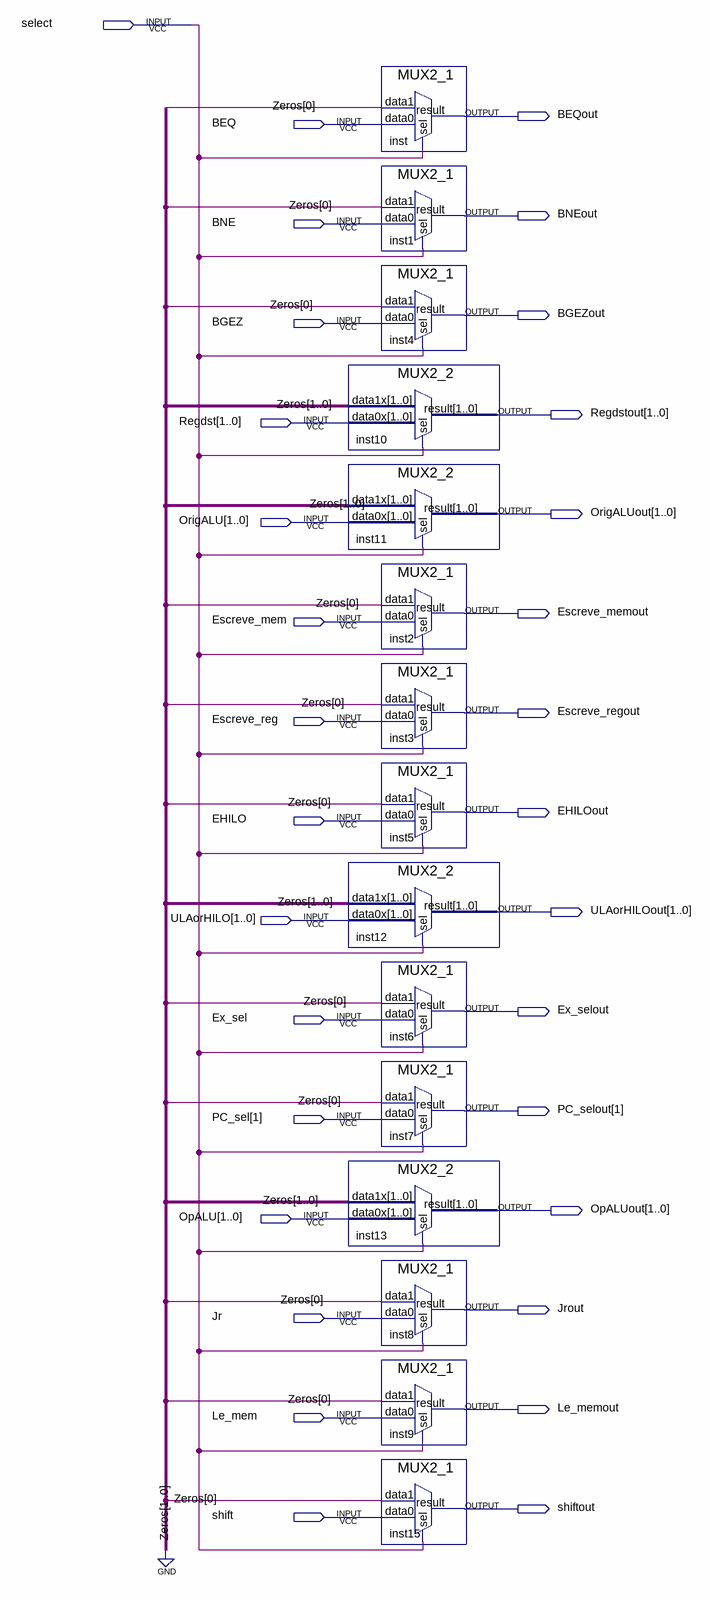
[diagram p0: schematic sheet]
// Quartus schematic MUXcontrole.bdf as structural Verilog: 15 symbols, 31 pins
module MUXcontrole (
  input  select,
  input  BEQ,
  input  BNE,
  input  BGEZ,
  input  [1:0] Regdst,
  input  [1:0] OrigALU,
  input  Escreve_mem,
  input  Escreve_reg,
  input  EHILO,
  input  [1:0] ULAorHILO,
  input  Ex_sel,
  input  [1:1] PC_sel,
  input  [1:0] OpALU,
  input  Jr,
  input  Le_mem,
  input  shift,
  output BEQout,
  output BNEout,
  output BGEZout,
  output [1:0] Regdstout,
  output [1:0] OrigALUout,
  output Escreve_memout,
  output Escreve_regout,
  output EHILOout,
  output [1:0] ULAorHILOout,
  output Ex_selout,
  output [1:1] PC_selout,
  output [1:0] OpALUout,
  output Jrout,
  output Le_memout,
  output shiftout
);

  MUX2_1 inst (.data1(1'b0), .data0(BEQ), .sel(select), .result(BEQout));
  MUX2_1 inst1 (.data1(1'b0), .data0(BNE), .sel(select), .result(BNEout));
  MUX2_1 inst4 (.data1(1'b0), .data0(BGEZ), .sel(select), .result(BGEZout));
  MUX2_2 inst10 (.data1x(2'b00), .data0x(Regdst), .sel(select), .result(Regdstout));
  MUX2_2 inst11 (.data1x(2'b00), .data0x(OrigALU), .sel(select), .result(OrigALUout));
  MUX2_1 inst2 (.data1(1'b0), .data0(Escreve_mem), .sel(select), .result(Escreve_memout));
  MUX2_1 inst3 (.data1(1'b0), .data0(Escreve_reg), .sel(select), .result(Escreve_regout));
  MUX2_1 inst5 (.data1(1'b0), .data0(EHILO), .sel(select), .result(EHILOout));
  MUX2_2 inst12 (.data1x(2'b00), .data0x(ULAorHILO), .sel(select), .result(ULAorHILOout));
  MUX2_1 inst6 (.data1(1'b0), .data0(Ex_sel), .sel(select), .result(Ex_selout));
  MUX2_1 inst7 (.data1(1'b0), .data0(PC_sel[1]), .sel(select), .result(PC_selout[1]));
  MUX2_2 inst13 (.data1x(2'b00), .data0x(OpALU), .sel(select), .result(OpALUout));
  MUX2_1 inst8 (.data1(1'b0), .data0(Jr), .sel(select), .result(Jrout));
  MUX2_1 inst9 (.data1(1'b0), .data0(Le_mem), .sel(select), .result(Le_memout));
  MUX2_1 inst15 (.data1(1'b0), .data0(shift), .sel(select), .result(shiftout));
endmodule
